# EasyEDA Pro project 4310_2025-11-30.epro

# Schematic Schematic1
Board Name: Board1; Create Date: 2025-10-22; Page Name: P1; Project Name: 4310_ms_new; Schematic Name: Schematic1; Update Date: 2025-10-28; Company: 嘉立创EDA; Page Size: A4; Version: V1.0
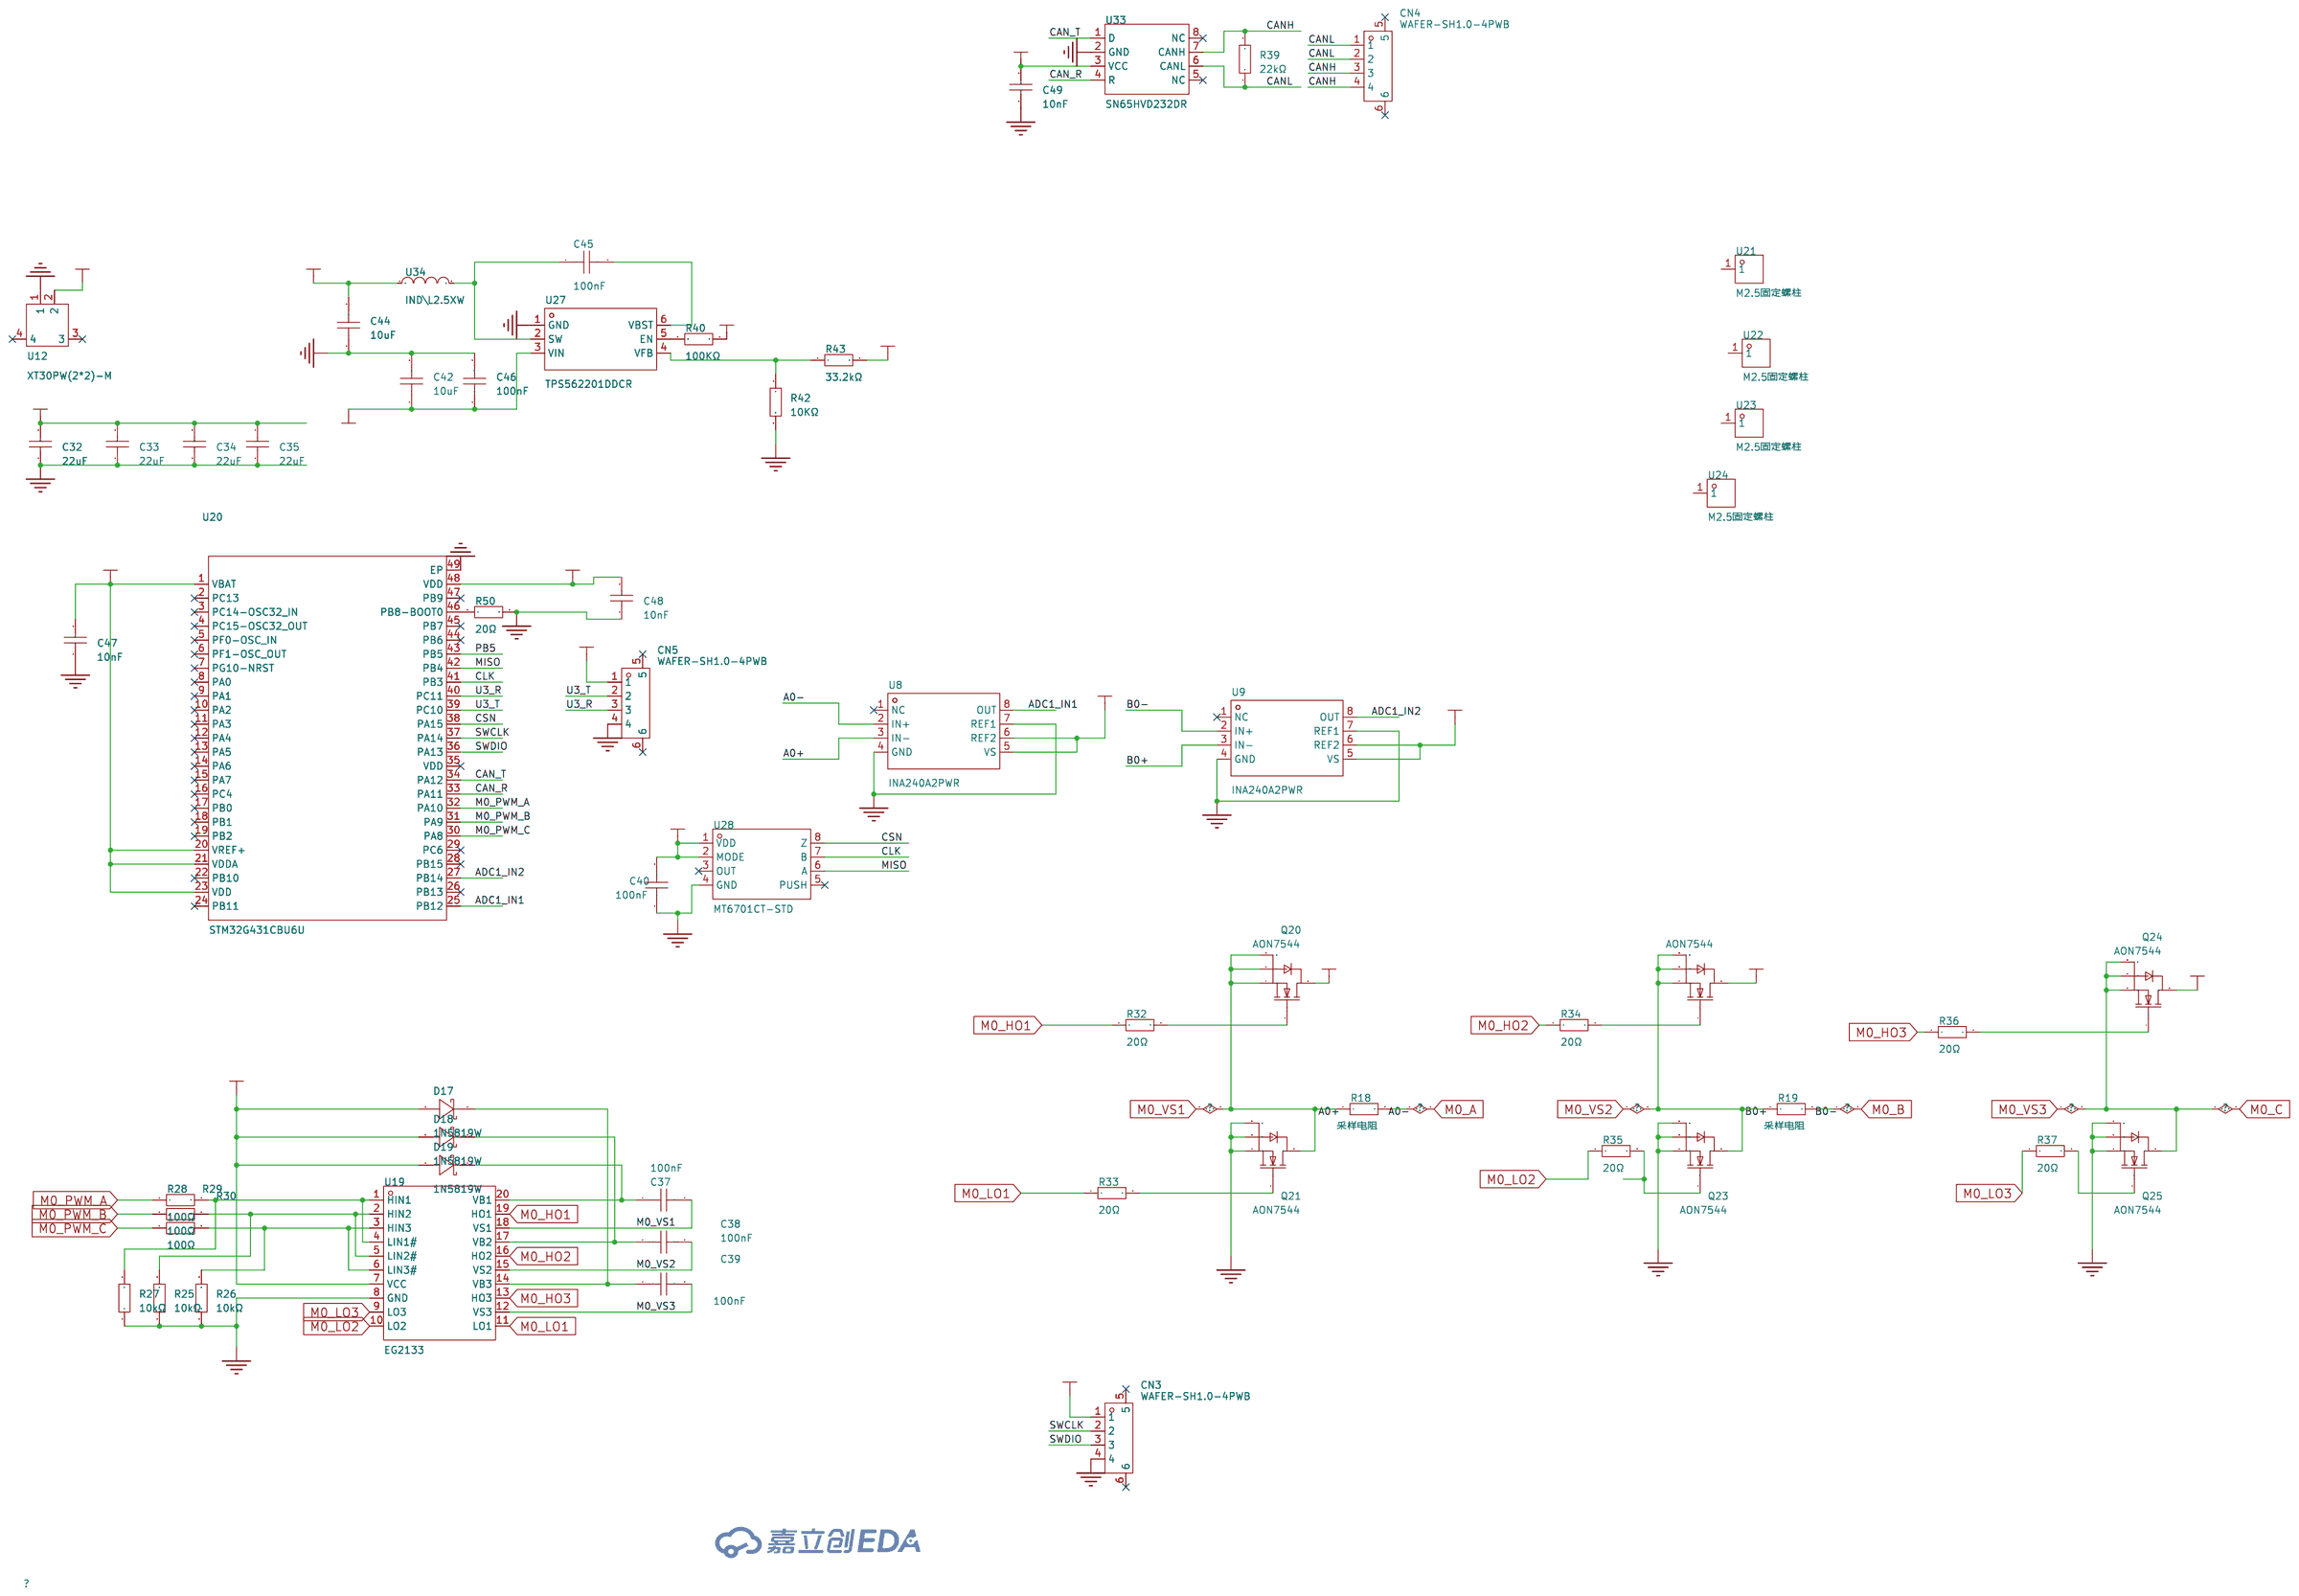
[diagram p0: schematic sheet]

## Parts
C32  22uF  [C1206]
C33  22uF  [C1206]
C34  22uF  [C1206]
C35  22uF  [C1206]
C37  100nF  [C0402]
C38  100nF  [C0402]
C39  100nF  [C0402]
C40  100nF  [C0603]
C42  10uF  [C0805]
C44  10uF  [C0805]
C45  100nF  [C0805]
C46  100nF  [C0805]
C47  10nF  [C0603]
C48  10nF  [C0603]
C49  10nF  [C0603]
CN3  WAFER-SH1.0-4PWB  [CONN-SMD_4P-P1.00_WAFER-SH1.0-4PWB]
CN4  WAFER-SH1.0-4PWB  [CONN-SMD_4P-P1.00_WAFER-SH1.0-4PWB]
CN5  WAFER-SH1.0-4PWB  [CONN-SMD_4P-P1.00_WAFER-SH1.0-4PWB]
D17  1N5819W  [SOD-123_L2.7-W1.6-LS3.7-RD-1]
D18  1N5819W  [SOD-123_L2.7-W1.6-LS3.7-RD-1]
D19  1N5819W  [SOD-123_L2.7-W1.6-LS3.7-RD-1]
Q20  AON7544  [DFN-8_L3.3-W3.3-P0.65-BL-2]
Q21  AON7544  [DFN-8_L3.3-W3.3-P0.65-BL-2]
Q22  AON7544  [DFN-8_L3.3-W3.3-P0.65-BL-2]
Q23  AON7544  [DFN-8_L3.3-W3.3-P0.65-BL-2]
Q24  AON7544  [DFN-8_L3.3-W3.3-P0.65-BL-2]
Q25  AON7544  [DFN-8_L3.3-W3.3-P0.65-BL-2]
R18  采样电阻  [R1206]
R19  采样电阻  [R1206]
R25  10kΩ  [R0402]
R26  10kΩ  [R0402]
R27  10kΩ  [R0402]
R28  100Ω  [R0402]
R29  100Ω  [R0402]
R30  100Ω  [R0402]
R32  20Ω  [R0402]
R33  20Ω  [R0402]
R34  20Ω  [R0402]
R35  20Ω  [R0402]
R36  20Ω  [R0402]
R37  20Ω  [R0402]
R39  22kΩ  [R0603]
R40  100KΩ  [R0603]
R42  10KΩ  [R0603]
R43  33.2kΩ  [R0603]
R50  20Ω  [R0603]
U8  INA240A2PWR  [TSSOP-8_L4.4-W3.0-P0.65-LS6.4-BL]
U9  INA240A2PWR  [TSSOP-8_L4.4-W3.0-P0.65-LS6.4-BL]
U12  XT30PW(2*2)-M  [CONN-TH_XT30PW-M]
U19  EG2133  [TSSOP-20_L6.5-W4.4-P0.65-LS6.4-BL]
U20  STM32G431CBU6U  [UFQFPN-48_L7.0-W7.0-P0.50-BL-EP5.6]
U21  M2.5固定螺柱  [SMD_BD5.0-L5.0-D2.6]
U22  M2.5固定螺柱  [SMD_BD5.0-L5.0-D2.6]
U23  M2.5固定螺柱  [SMD_BD5.0-L5.0-D2.6]
U24  M2.5固定螺柱  [SMD_BD5.0-L5.0-D2.6]
U27  TPS562201DDCR  [SOT-23-6_L2.9-W1.6-P0.95-LS2.8-BR]
U28  MT6701CT-STD  [SOP-8_L4.9-W3.9-P1.27-LS6.0-BL]
U33  SN65HVD232DR  [SOIC-8_L5.0-W4.0-P1.27-LS6.0-BL]
U34  IND\L2.5XW  [IND-SMD_L2.5-W2.0_YXNAQ252010-3R3M]

## Library data of the parts
C32-C35 = CL31A226KAHNNNE: 容值:22uF;精度:±10%;额定电压:25V;温度系数:X5R;; LCSC Part Name: 22uF ±10% 25V; Supplier Part: C12891; Manufacturer: SAMSUNG(三星); Supplier Footprint: 1206; JLCPCB Part Class: 基础库; Datasheet: https://item.szlcsc.com/datasheet/CL31A226KAHNNNE/13537.html; Supplier: LCSC; Tolerance: ±10%; Voltage Rating: 25V; Temperature Coefficient: X5R
C37-C39 = CL05B104KB54PNC: 容值:100nF;精度:±10%;额定电压:50V;温度系数:X7R;; LCSC Part Name: 100nF ±10% 50V; Supplier Part: C307331; Manufacturer: SAMSUNG(三星); Supplier Footprint: 0402; JLCPCB Part Class: 基础库; Datasheet: https://item.szlcsc.com/datasheet/CL05B104KB54PNC/291005.html; Supplier: LCSC; Tolerance: ±10%; Voltage Rating: 50V; Temperature Coefficient: X7R
C40 = TCC0603X7R104K500CTS: 容值:100nF;精度:±10%;额定电压:50V;温度系数:X7R;; LCSC Part Name: 100nF ±10% 50V; Supplier Part: C282520; Manufacturer: CCTC(三环); Supplier Footprint: 0603; JLCPCB Part Class: 扩展库; Datasheet: https://atta.szlcsc.com/upload/public/pdf/source/20190418/C282727_578BF1B2FA7A061368DB08C32C351B39.pdf; Supplier: LCSC; Tolerance: ±10%; Voltage Rating: 50V; Temperature Coefficient: X7R
C42 C44 = CL21A106KAYNNNE_C15850: 容值:10uF;精度:±10%;额定电压:25V;温度系数:X5R;; LCSC Part Name: 10uF ±10% 25V; Supplier Part: C15850; Manufacturer: SAMSUNG(三星); Manufacturer Part: CL21A106KAYNNNE; Supplier Footprint: 0805; JLCPCB Part Class: 基础库; Datasheet: https://item.szlcsc.com/datasheet/CL21A106KAYNNNE/16532.html; Supplier: LCSC; Tolerance: ±10%; Voltage Rating: 25V; Temperature Coefficient: X5R
C45 C46 = CC0805KRX7R9BB104: 容值:100nF;精度:±10%;额定电压:50V;温度系数:X7R;; LCSC Part Name: 100nF ±10% 50V; Supplier Part: C49678; Manufacturer: YAGEO(国巨); Supplier Footprint: 0805; JLCPCB Part Class: 基础库; Datasheet: https://item.szlcsc.com/datasheet/CC0805KRX7R9BB104/50686.html; Supplier: LCSC; Tolerance: ±10%; Voltage Rating: 50V; Temperature Coefficient: X7R
C47-C49 = 0603B103K500NT: 容值:10nF;精度:±10%;额定电压:50V;温度系数:X7R;; LCSC Part Name: 10nF ±10% 50V; Supplier Part: C57112; Manufacturer: FH(风华); Supplier Footprint: 0603; JLCPCB Part Class: 基础库; Datasheet: https://item.szlcsc.com/datasheet/0603B103K500NT/58143.html; Supplier: LCSC; Tolerance: ±10%; Voltage Rating: 50V; Temperature Coefficient: X7R
CN3-CN5 = WAFER-SH1.0-4PWB: 插针结构:1x4P;间距:1mm;安装方式:卧贴;总PIN数:4P;排数:1;每排PIN数:4;额定电流:1A;工作温度范围:-25℃~+85℃;; LCSC Part Name: 1x4P 间距:1mm 卧贴; Supplier Part: C3029343; Manufacturer: XUNPU(讯普); Supplier Footprint: SMD,P=1mm,卧贴; JLCPCB Part Class: 扩展库; Datasheet: https://atta.szlcsc.com/upload/public/pdf/source/20220527/1879B8210BD3B2006BCEAC1A40D397B6.pdf; Supplier: LCSC; Pins Structure: 1x4P; Pitch: 1mm; Mounting Style: 卧贴; Number of Pins: 4P; Number of Rows: 1; Number of PINs Per Row: 4; Current Rating (Max): 1A; Operating Temperature Range: -25℃~+85℃
D17-D19 = 1N5819W: 二极管配置:-;正向压降(Vf):900mV@3A;直流反向耐压(Vr):40V;平均整流电流(Io):1A;; LCSC Part Name: 电压:40V 电流:1A; Supplier Part: C2905650; Manufacturer: TECH PUBLIC(台舟); Supplier Footprint: SOD-123; JLCPCB Part Class: 扩展库; Datasheet: https://atta.szlcsc.com/upload/public/pdf/source/20211020/7FEA34DA99E5285CBA3CC87767B82BE7.pdf; Supplier: LCSC; Forward Voltage (Vf@If): 900mV@3A; Reverse Voltage (Vr): 40V; Average Rectified Current (Io): 1A; Reverse Leakage Current (Ir): 1mA@40V
Q20-Q25 = AON7544: 类型:1个N沟道;漏源电压(Vdss):30V;连续漏极电流(Id):30A;导通电阻(RDS(on)@Vgs,Id):8.5mΩ@4.5V,20A;功率(Pd):3W;阈值电压(Vgs(th)@Id):1.2V@250uA;; LCSC Part Name: 1个N沟道 耐压:30V 电流:30A; Supplier Part: C315567; Manufacturer: AOS; Supplier Footprint: DFN-8(3x3); JLCPCB Part Class: 扩展库; Datasheet: https://atta.szlcsc.com/upload/public/pdf/source/20190614/C315567_E434D67BCCEB23ABC813CC1BF26EA614.pdf; Supplier: LCSC; Type: 1个N沟道; Drain Source Voltage (Vdss): 30V; Continuous Drain Current (Id): 30A; Drain Source On Resistance (RDS(on)@Vgs,Id): 8.5mΩ@4.5V,20A; Power Dissipation (Pd): 3W; Gate Threshold Voltage (Vgs(th)@Id): 1.2V@250uA; Total Gate Charge (Qg@Vgs): 22.5nC@10V; Input Capacitance (Ciss@Vds): 951pF; Reverse Transfer Capacitance (Crss@Vds): 157pF; Operating Temperature: -55℃~+150℃
R18 R19 = Res_1206: Supplier Footprint: 1206
R25-R27 = 0402WGF1202TCE: 电阻类型:厚膜电阻;阻值:12kΩ;精度:±1%;功率:62.5mW;工作电压:50V;温度系数:±100ppm/℃;; LCSC Part Name: 12kΩ ±1% 62.5mW 厚膜电阻; Supplier Part: C25752; Manufacturer: UNI-ROYAL(厚声); Supplier Footprint: 0402; JLCPCB Part Class: 基础库; Datasheet: https://item.szlcsc.com/datasheet/0402WGF1202TCE/26495.html; Supplier: LCSC; Type: 厚膜电阻; Tolerance: ±1%; Power(Watts): 62.5mW; Voltage-Supply(Max): 50V; Temperature Coefficient: ±100ppm/℃; Operating Temperature: -55℃~+155℃
R28-R30 R32-R37 = 0402WGF1200TCE: 电阻类型:厚膜电阻;阻值:120Ω;精度:±1%;功率:62.5mW;工作电压:50V;温度系数:±100ppm/℃;; LCSC Part Name: 120Ω ±1% 62.5mW 厚膜电阻; Supplier Part: C25079; Manufacturer: UNI-ROYAL(厚声); Supplier Footprint: 0402; JLCPCB Part Class: 基础库; Datasheet: https://item.szlcsc.com/datasheet/0402WGF1200TCE/25822.html; Supplier: LCSC; Type: 厚膜电阻; Tolerance: ±1%; Power(Watts): 62.5mW; Voltage-Supply(Max): 50V; Temperature Coefficient: ±100ppm/℃; Operating Temperature: -55℃~+155℃
R39 = 0603WAF2202T5E: 电阻类型:厚膜电阻;阻值:22kΩ;精度:±1%;功率:100mW;最大工作电压:75V;温度系数:±100ppm/℃;; LCSC Part Name: 22kΩ ±1% 100mW 厚膜电阻; Supplier Part: C31850; Manufacturer: UNI-ROYAL(厚声); Supplier Footprint: 0603; JLCPCB Part Class: 基础库; Datasheet: https://atta.szlcsc.com/upload/public/pdf/source/20200306/C422600_1E6D84923E4A46A82E41ADD87F860B5C.pdf; Supplier: LCSC; Type: 厚膜电阻; Tolerance: ±1%; Power(Watts): 100mW; Overload Voltage (Max): 75V; Temperature Coefficient: ±100ppm/℃; Operating Temperature Range: -55℃~+155℃
R40 R42 = 0603WAF1004T5E: 电阻类型:厚膜电阻;阻值:1MΩ;精度:±1%;功率:100mW;; LCSC Part Name: 1MΩ ±1% 100mW; Supplier Part: C22935; Manufacturer: UNI-ROYAL(厚声); Supplier Footprint: 0603; JLCPCB Part Class: 基础库; Datasheet: https://atta.szlcsc.com/upload/public/pdf/source/20200306/C422600_1E6D84923E4A46A82E41ADD87F860B5C.pdf; Supplier: LCSC; Type: 厚膜电阻; Tolerance: ±1%; Power(Watts): 100mW; Temperature Coefficient: ±100ppm/℃; Overload Voltage (Max): 75V; Operating Temperature Range: -55℃~+155℃
R43 = 0603WAF750JT5E: 电阻类型:厚膜电阻;阻值:75Ω;精度:±1%;功率:100mW;工作电压:75V;温度系数:±100ppm/℃;; LCSC Part Name: 75Ω ±1% 100mW 厚膜电阻; Supplier Part: C4275; Manufacturer: UNI-ROYAL(厚声); Supplier Footprint: 0603; Datasheet: https://item.szlcsc.com/datasheet/0603WAF750JT5E/4682.html; Supplier: LCSC; Type: 厚膜电阻; Tolerance: ±1%; Power(Watts): 100mW; Voltage-Supply(Max): 75V; Temperature Coefficient: ±100ppm/℃; Operating Temperature: -55℃~+155℃
R50 = 0603WAF200JT5E: 电阻类型:厚膜电阻;阻值:20Ω;精度:±1%;功率:100mW;最大工作电压:75V;温度系数:±100ppm/℃;; LCSC Part Name: 20Ω ±1% 100mW 厚膜电阻; Supplier Part: C22950; Manufacturer: UNI-ROYAL(厚声); Supplier Footprint: 0603; JLCPCB Part Class: 基础库; Datasheet: https://atta.szlcsc.com/upload/public/pdf/source/20200306/C422600_1E6D84923E4A46A82E41ADD87F860B5C.pdf; Supplier: LCSC; Type: 厚膜电阻; Tolerance: ±1%; Power(Watts): 100mW; Overload Voltage (Max): 75V; Temperature Coefficient: ±100ppm/℃; Operating Temperature Range: -55℃~+155℃
U8 U9 = INA240A2PWR: 放大器数:单路;; Supplier Part: C129949; Manufacturer: TI(德州仪器); Supplier Footprint: TSSOP-8; JLCPCB Part Class: 扩展库; Datasheet: https://www.ti.com/cn/lit/gpn/ina240; Supplier: LCSC; Number of Channels: 单路; Supply Current: 1.8mA; Operating Temperature: -40℃~+125℃
U12 = XT30PW(2*2)-M: Supplier Part: C9900097120; JLCPCB Part Class: 扩展库; Supplier: LCSC
U19 = EG2133_C190343: EG2133是一款高性价比的三相半桥驱动芯片，配合六颗Nmos可以组成三相直流无刷电机驱动器。; Supplier Part: C190343; Manufacturer: EG(屹晶微); Supplier Footprint: TSSOP-20; JLCPCB Part Class: Extended Part; Datasheet: https://atta.szlcsc.com/upload/public/pdf/source/20220627/F8A393EEBF3325F22DCB485BC683267F.pdf; Supplier: LCSC
U20 = STM32G431CBU6U: CPU内核:CM4;程序存储容量:128KB;RAM总容量:32KB;GPIO端口数量:42;工作电压范围:1.71V~3.6V;CPU最大主频:170MHz;程序存储器类型:FLASH;; Supplier Part: C1341712; Manufacturer: ST(意法半导体); Supplier Footprint: UFQFPN-48(7x7); JLCPCB Part Class: 扩展库; Datasheet: https://atta.szlcsc.com/upload/public/pdf/source/20210607/F3CD0646E5D00AAFDE875C196C2D7333.pdf; Supplier: LCSC; CPU Core: CM4; Program Storage Size: 128KB; RAM Size: 32KB; GPIO Ports Number: 42; Operating Voltage Range: 1.71V~3.6V; CPU Maximum Speed: 170MHz; Program Memory Type: FLASH; Operating Temperature Range: -40℃~+85℃; ADC (Bit): 12bit; DAC (Bit): 12bit; Peripheral/Function: PWM；PWM; Internal Oscillator: 有
U21-U24 = M2.5固定螺柱: Supplier Part: C9900023457; Supplier Footprint: M2.5; JLCPCB Part Class: 扩展库; Supplier: LCSC
U27 = TPS562201DDCR: 功能类型:降压型;工作电压:4.5V~17V;输出电压:768mV~7V;输出电流:2A;输出类型:可调;; LCSC Part Name: 4.5V至17V输入、2A同步降压稳压器; Supplier Part: C90061; Manufacturer: TI(德州仪器); Supplier Footprint: SOT-6; JLCPCB Part Class: 扩展库; Datasheet: https://www.ti.com/cn/lit/gpn/tps562201; Supplier: LCSC; Function: 降压型; Voltage - Supply: 4.5V~17V; Output Voltage: 768mV~7V; Output Current: 2A; Frequency - Switching: 580kHz; Operating Temperature: -40℃~+125℃@(TJ); Synchronous Rectifier: 是; Number of Outputs: 1; Topology: 降压式; Switch tube (built-in/external): 内置; Output Type: 可调
U28 = MT6701CT-STD: 磁性编码器 磁性编码开关 磁性角度检测IC 可编程磁性角度位置芯片; LCSC Part Name: 霍尔在线编程角度位置传感器; Supplier Part: C2856764; Manufacturer: MagnTek(麦歌恩); Supplier Footprint: SOP-8; JLCPCB Part Class: 扩展库; Datasheet: https://atta.szlcsc.com/upload/public/pdf/source/20210901/89396AA55DF26524CEF7734A3D9C2FB3.pdf; Supplier: LCSC
U33 = SN65HVD232DR: 类型:CAN收发器;数据速率:1Mbps;; LCSC Part Name: 3.3-V CAN 收发器; Supplier Part: C30530; Manufacturer: TI(德州仪器); Supplier Footprint: SOIC-8; JLCPCB Part Class: 扩展库; Datasheet: https://www.ti.com/cn/lit/gpn/sn65hvd230; Supplier: LCSC; Type: CAN收发器; Data Rate: 1Mbps; Operating Temperature: -40℃~+85℃
U34 = IND\L2.5XW: Supplier Part: C9900016568; Supplier Footprint: 2.2uH/60; JLCPCB Part Class: 扩展库; Supplier: LCSC

## Nets
GND: C32.1 C33.1 C34.1 C35.1 C40.1 C42.2 C44.1 C46.2 C47.1 C48.1 C49.1 CN3.4 CN5.4 Q21.1(S) Q21.2(S) Q21.3(S) Q23.1(S) Q23.2(S) Q23.3(S) Q25.1(S) Q25.2(S) Q25.3(S) R25.1 R26.1 R27.1 R42.2 R50.2 U8.4(GND) U8.7(REF1) U9.4(GND) U9.7(REF1) U12.1 U19.8(GND) U20.49(EP) U27.1(GND) U28.4(GND) U33.2(GND)
VCC_3.3V: C40.2 C44.2 C47.2 C48.2 C49.2 CN3.1 CN5.1 R43.2 U8.5(VS) U8.6(REF2) U9.5(VS) U9.6(REF2) U20.1(VBAT) U20.20(VREF+) U20.21(VDDA) U20.23(VDD) U20.48(VDD) U28.1(VDD) U28.2(MODE) U33.3(VCC) U34.1
A0+: C37.2 Q20.1(S) Q20.2(S) Q20.3(S) Q21.5(D) R18.1 U8.3(IN-) U19.18(VS1)
A0-: R18.2 U8.2(IN+)
ADC1_IN1: U8.8(OUT) U20.25(PB12)
ADC1_IN2: U9.8(OUT) U20.27(PB14)
B0+: C38.2 Q22.1(S) Q22.2(S) Q22.3(S) Q23.5(D) R19.1 U9.3(IN-) U19.15(VS2)
B0-: R19.2 U9.2(IN+)
CAN_R: U20.33(PA11) U33.4(R)
CAN_T: U20.34(PA12) U33.1(D)
CANH: CN4.3 CN4.4 R39.2 U33.7(CANH)
CANL: CN4.1 CN4.2 R39.1 U33.6(CANL)
CLK: U20.41(PB3) U28.7(B)
CSN: U20.38(PA15) U28.8(Z)
M0_C: C39.2 Q24.1(S) Q24.2(S) Q24.3(S) Q25.5(D) U19.12(VS3)
M0_HO1: R32.1 U19.19(HO1)
M0_HO2: R34.1 U19.16(HO2)
M0_HO3: R36.1 U19.13(HO3)
M0_LO1: R33.1 U19.11(LO1)
M0_LO2: R35.1 U19.10(LO2)
M0_LO3: R37.1 U19.9(LO3)
M0_PWM_A: R28.1 U20.32(PA10)
M0_PWM_B: R29.1 U20.31(PA9)
M0_PWM_C: R30.1 U20.30(PA8)
MISO: U20.42(PB4) U28.6(A)
PB5: U20.43(PB5)
SWCLK: CN3.2 U20.37(PA14)
SWDIO: CN3.3 U20.36(PA13)
U3_R: CN5.3 U20.40(PC11)
U3_T: CN5.2 U20.39(PC10)
VM: C32.2 C33.2 C34.2 C35.2 C42.1 C46.1 D17.2(A) D18.2(A) D19.2(A) Q20.5(D) Q22.5(D) Q24.5(D) R40.1 U12.2 U19.7(VCC) U27.3(VIN)
$1N3270: Q20.4(G) R32.2
$1N3271: Q21.4(G) R33.2
$1N3277: Q22.4(G) R34.2
$1N3278: Q23.4(G) R35.2
$1N3284: Q24.4(G) R36.2
$1N3285: Q25.4(G) R37.2
$1N3290: R25.2 R29.2 U19.2(HIN2) U19.5(LIN2#)
$1N3300: C37.1 D19.1(K) U19.20(VB1)
$1N3301: C38.1 D18.1(K) U19.17(VB2)
$1N3302: C39.1 D17.1(K) U19.14(VB3)
$1N3388: R27.2 R28.2 U19.1(HIN1) U19.4(LIN1#)
$1N3389: R26.2 R30.2 U19.3(HIN3) U19.6(LIN3#)
$1N3414: C45.1 U27.2(SW) U34.2
$1N3417: C45.2 U27.6(VBST)
$1N3418: R40.2 U27.5(EN)
$1N3419: R42.1 R43.1 U27.4(VFB)
$1N10197: R50.1 U20.46(PB8-BOOT0)

Not connected (* = marked no-connect by the designer): CN3 5* 6*; CN4 5* 6*; CN5 5* 6*; U8 1(NC)*; U9 1(NC)*; U12 3* 4*; U20 2(PC13)* 3(PC14-OSC32_IN)* 4(PC15-OSC32_OUT)* 5(PF0-OSC_IN)* 6(PF1-OSC_OUT)* 7(PG10-NRST)* 8(PA0)* 9(PA1)* 10(PA2)* 11(PA3)* 12(PA4)* 13(PA5)* 14(PA6)* 15(PA7)* 16(PC4)* 17(PB0)* 18(PB1)* 19(PB2)* 22(PB10)* 24(PB11)* 26(PB13)* 28(PB15)* 29(PC6)* 35(VDD)* 44(PB6)* 45(PB7)* 47(PB9)*; U21 1; U22 1; U23 1; U24 1; U28 3(OUT)* 5(PUSH)*; U33 5(NC)* 8(NC)*

# Board PCB1
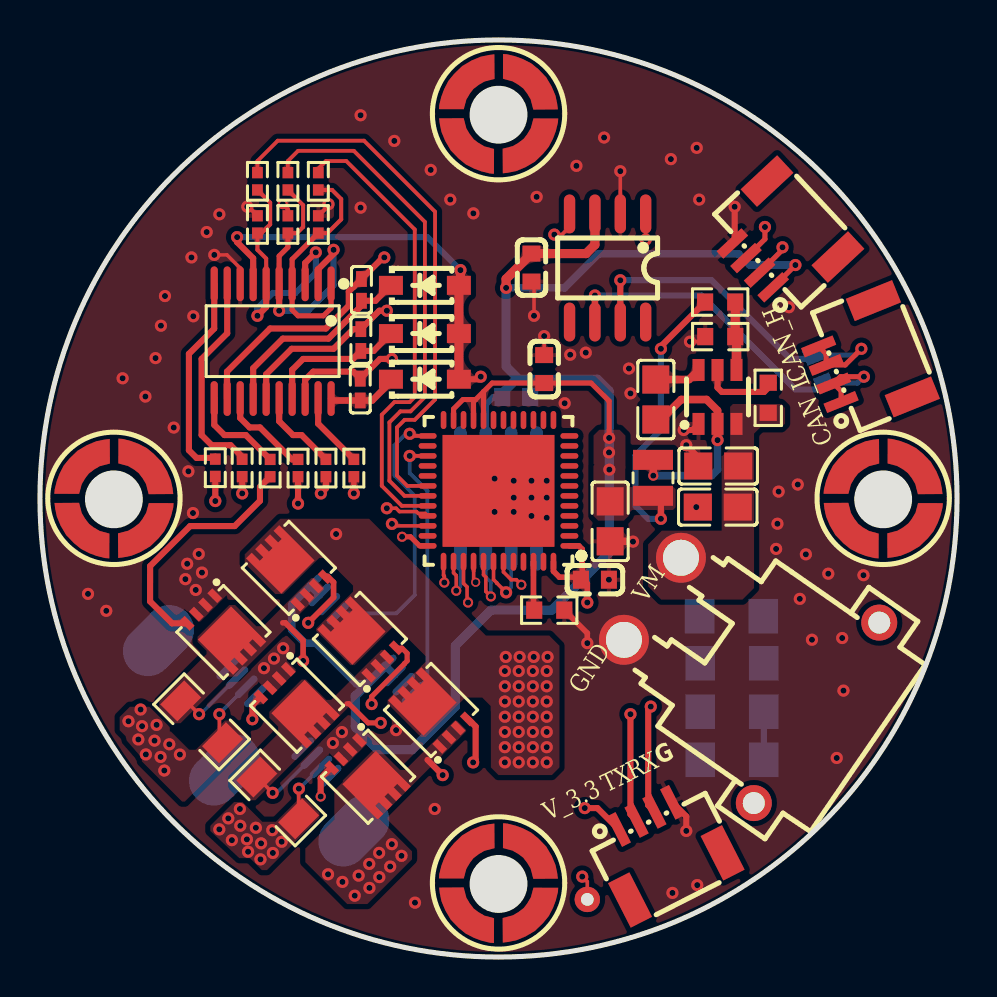
[diagram p1: board, top side]
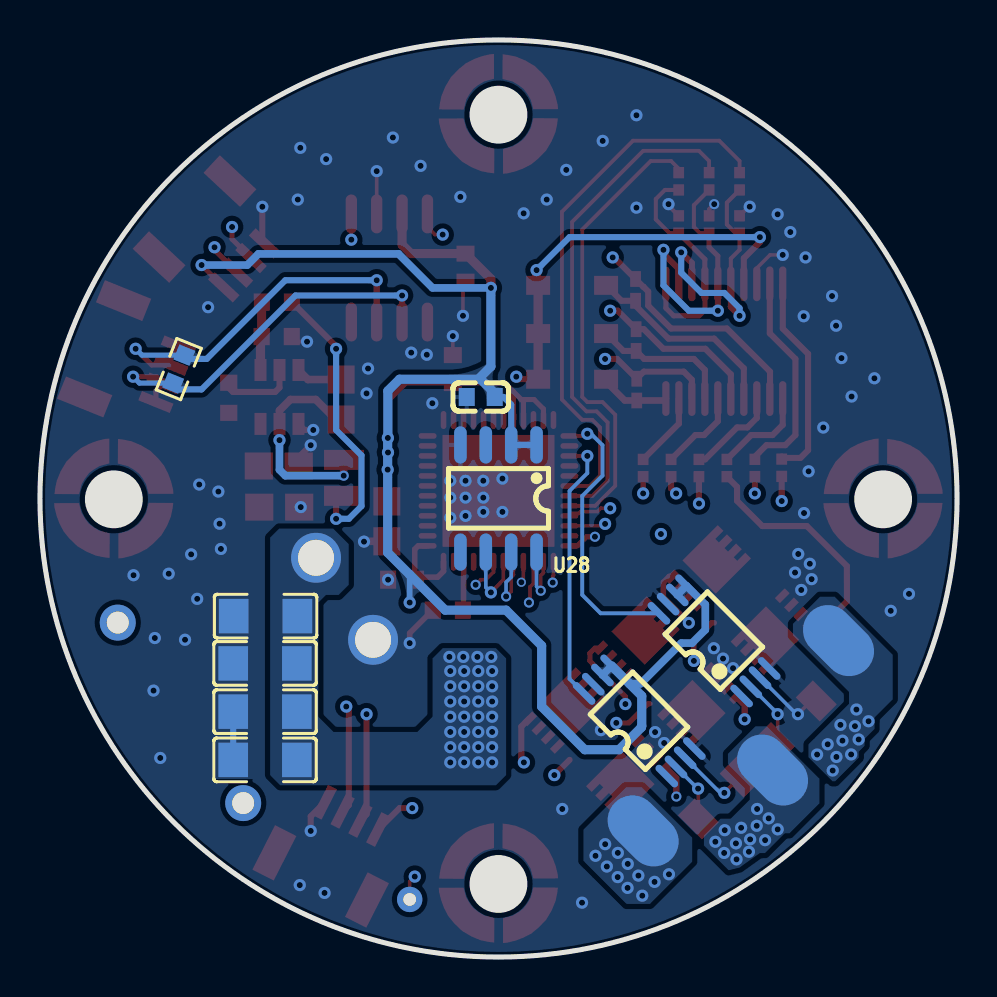
[diagram p2: board, bottom side, seen from below]

Outline 45.9 x 45.9 mm; copper layers: Top Layer, Inner1, Inner2, Bottom Layer. Coordinates in mm from the lower left corner of the outline.
Outline path: circle c22.95,22.95 r22.95
Stack: Top Layer 0.035mm 外层铜厚1oz / Dielectric1 0.2104mm 7628 RC49% 8.6mil / Inner1 0.0152mm 内层铜厚 / Dielectric2 1.065mm 1.1mm H/HOZ Copper / Inner2 0.0152mm 内层铜厚 / Dielectric3 0.2104mm 7628 RC49% 8.6mil / Bottom Layer 0.035mm 外层铜厚1oz

## Design rules (mm)
template: 自定义配置
spacing copperThickness1oz (default): track to track 0.102, other pairs 0.152 to 0.3
spacing copperThickness2oz: track to track 0.203, other pairs 0.152 to 0.3
track width copperThickness1oz (default): min 0.127, default 0.254, max 2.54
track width copperThickness2oz: min 0.203, default 0.254, max 2.54
differential pair differentialPair (default): width min 0.127, default 0.254, max 2.54; gap min 0.152, default 0.152
via viaSize (default): diameter min 0.457, default 0.61, max 10; hole min 0.3, default 0.305, max 6.3

## Placement (name value [footprint] x y rotation side)
C32  22uF  [C1206]  34.61 17.06 180 bottom
C33  22uF  [C1206]  34.63 14.69 180 bottom
C34  22uF  [C1206]  34.63 12.28 180 bottom
C35  22uF  [C1206]  34.63 9.87 180 bottom
C37  100nF  [C0402]  16.03 28.4 90 top
C38  100nF  [C0402]  16.06 30.88 90 top
C39  100nF  [C0402]  16.09 33.39 90 top
C40  100nF  [C0603]  23.84 28.03 180 bottom
C42  10uF  [C0805]  33.92 22.52 180 top
C44  10uF  [C0805]  28.54 21.81 90 top
C45  100nF  [C0805]  30.82 27.9 90 top
C46  100nF  [C0805]  33.94 24.58 180 top
C47  10nF  [C0603]  25.24 29.43 270 top
C48  10nF  [C0603]  27.78 18.89 180 top
C49  10nF  [C0603]  24.6 34.51 90 top
CN3  WAFER-SH1.0-4PWB  [CONN-SMD_4P-P1.00_WAFER-SH1.0-4PWB]  36.92 35.78 133 top
CN4  WAFER-SH1.0-4PWB  [CONN-SMD_4P-P1.00_WAFER-SH1.0-4PWB]  41.11 29.81 112 top
CN5  WAFER-SH1.0-4PWB  [CONN-SMD_4P-P1.00_WAFER-SH1.0-4PWB]  31.08 5.55 27 top
D17  1N5819W  [SOD-123_L2.7-W1.6-LS3.7-RD-1]  19.27 33.62 0 top
D18  1N5819W  [SOD-123_L2.7-W1.6-LS3.7-RD-1]  19.27 31.2 0 top
D19  1N5819W  [SOD-123_L2.7-W1.6-LS3.7-RD-1]  19.27 28.92 0 top
NOREF  -  [Pad_e1705]  9.23 9.36 135 top
NOREF#2  -  [Pad_e1706]  15.71 6.31 135 top
NOREF#3  -  [Pad_e1704]  5.93 15.84 135 top
NOREF#4  -  [Pad_e1522]  27.39 2.88 0 top
Q20  AON7544  [DFN-8_L3.3-W3.3-P0.65-BL-2]  13.04 18.89 45 top
Q21  AON7544  [DFN-8_L3.3-W3.3-P0.65-BL-2]  8.6 16.85 225 top
Q22  AON7544  [DFN-8_L3.3-W3.3-P0.65-BL-2]  16.6 15.33 45 top
Q23  AON7544  [DFN-8_L3.3-W3.3-P0.65-BL-2]  12.28 13.17 225 top
Q24  AON7544  [DFN-8_L3.3-W3.3-P0.65-BL-2]  20.16 11.77 45 top
Q25  AON7544  [DFN-8_L3.3-W3.3-P0.65-BL-2]  15.84 9.61 225 top
R18  采样电阻  [R1206]  8.09 11.77 315 top
R19  采样电阻  [R1206]  11.9 7.96 315 top
R25  10kΩ  [R0402]  12.41 36.67 270 top
R26  10kΩ  [R0402]  10.88 36.67 270 top
R27  10kΩ  [R0402]  13.93 36.67 270 top
R28  100Ω  [R0402]  13.93 38.82 270 top
R29  100Ω  [R0402]  12.41 38.82 270 top
R30  100Ω  [R0402]  10.88 38.82 270 top
R32  20Ω  [R0402]  15.71 24.47 270 top
R33  20Ω  [R0402]  11.52 24.47 270 top
R34  20Ω  [R0402]  14.31 24.47 270 top
R35  20Ω  [R0402]  8.78 24.49 270 top
R36  20Ω  [R0402]  12.92 24.47 270 top
R37  20Ω  [R0402]  10.12 24.48 270 top
R39  22kΩ  [R0603]  38.95 29.43 112 bottom
R40  100KΩ  [R0603]  36.45 27.99 90 top
R42  10KΩ  [R0603]  34.05 31.05 180 top
R43  33.2kΩ  [R0603]  34.04 32.78 180 top
R50  20Ω  [R0603]  25.49 17.36 0 top
U8  INA240A2PWR  [TSSOP-8_L4.4-W3.0-P0.65-LS6.4-BL]  12.16 15.82 135 bottom
U9  INA240A2PWR  [TSSOP-8_L4.4-W3.0-P0.65-LS6.4-BL]  15.91 11.82 135 bottom
U12  XT30PW(2*2)-M  [CONN-TH_XT30PW-M]  34.76 15.08 55.2 top
U19  EG2133  [TSSOP-20_L6.5-W4.4-P0.65-LS6.4-BL]  11.65 30.82 180 top
U20  STM32G431CBU6U  [UFQFPN-48_L7.0-W7.0-P0.50-BL-EP5.6]  22.95 23.33 90 top
U21  M2.5固定螺柱  [SMD_BD5.0-L5.0-D2.6]  22.95 3.7 0 top
U22  M2.5固定螺柱  [SMD_BD5.0-L5.0-D2.6]  3.7 22.95 0 top
U23  M2.5固定螺柱  [SMD_BD5.0-L5.0-D2.6]  22.95 42.2 0 top
U24  M2.5固定螺柱  [SMD_BD5.0-L5.0-D2.6]  42.2 22.95 0 top
U27  TPS562201DDCR  [SOT-23-6_L2.9-W1.6-P0.95-LS2.8-BR]  33.91 28.03 270 top
U28  MT6701CT-STD  [SOP-8_L4.9-W3.9-P1.27-LS6.0-BL]  22.95 22.95 0 bottom
U33  SN65HVD232DR  [SOIC-8_L5.0-W4.0-P1.27-LS6.0-BL]  28.41 34.49 180 top
U34  IND\L2.5XW  [IND-SMD_L2.5-W2.0_YXNAQ252010-3R3M]  30.68 23.98 270 top

## Footprints (pads in the part's own frame, mm; a bottom-side part is the same pattern mirrored in y, then rotated)
C0402
  rect 0.79x0.54 smd: 1(-0.545,0) 2(0.545,0)
C0603
  rect 0.8x0.9 smd: 1(-0.7,0) 2(0.7,0)
C0805
  rect 1.41x1.35 smd: 1(-1,0) 2(1,0)
C1206
  rect 1.485x1.728 smd: 1(-1.593,0) 2(1.593,0)
CONN-SMD_4P-P1.00_WAFER-SH1.0-4PWB
  rect 0.5x1.7 smd: 1(-1.5,1.7) 2(-0.5,1.7) 3(0.5,1.7) 4(1.5,1.7)
  rect 1.2x2.5 smd: 5(-2.6,-1.7) 6(2.6,-1.7)
CONN-TH_XT30PW-M
  round 2.5 hole 1.8: 1(-2.5,5) 2(2.5,5)
  round 1.8 hole 1.1: 3(5.5,-5) 4(-5.5,-5)
DFN-8_L3.3-W3.3-P0.65-BL-2
  rect 0.35x0.7 smd: 1(-0.975,-0.765) 2(-0.325,-0.765) 3(0.325,-0.765) 4(0.975,-0.765)
  custom 2.352x2.498 smd: 5(0,0.765)
IND-SMD_L2.5-W2.0_YXNAQ252010-3R3M
  rect 1x2 smd: 1(0.9,0) 2(-0.9,0)
Pad_e1522
  round 1.27 hole 0.635: 1(0,0)
Pad_e1704
  rrect 2.5x4 smd far side: 1(0,0)
Pad_e1705
  rrect 2.5x4 smd far side: 1(0,0)
Pad_e1706
  rrect 2.5x4 smd far side: 1(0,0)
R0402
  rect 0.566x0.54 smd: 1(-0.433,0) 2(0.433,0)
R0603
  rect 0.806x0.864 smd: 1(-0.753,0) 2(0.753,0)
R1206
  rect 1.208x1.701 smd: 1(-1.479,0) 2(1.479,0)
SMD_BD5.0-L5.0-D2.6
  custom 2.75x2.784 smd: 1(-1.599,-1.645) 1(1.598,1.645)
  custom 2.784x2.749 smd: 1(-1.589,1.638) 1(1.599,-1.633)
SOD-123_L2.7-W1.6-LS3.7-RD-1
  rect 1.2x0.95 smd: 1(-1.7,0) 2(1.7,0)
SOIC-8_L5.0-W4.0-P1.27-LS6.0-BL
  oval 0.569x1.95 smd: 1(-1.905,-2.705) 2(-0.635,-2.705) 3(0.635,-2.705) 4(1.905,-2.705) 5(1.905,2.705) 6(0.635,2.705) 7(-0.635,2.705) 8(-1.905,2.705)
SOP-8_L4.9-W3.9-P1.27-LS6.0-BL
  oval 0.63x1.865 smd: 1(-1.905,-2.683) 2(-0.635,-2.683) 3(0.635,-2.683) 4(1.905,-2.683) 5(1.905,2.683) 6(0.635,2.683) 7(-0.635,2.683) 8(-1.905,2.683)
SOT-23-6_L2.9-W1.6-P0.95-LS2.8-BR
  rect 1.1x0.6 smd: 1(1.35,-0.95) 2(1.35,0) 3(1.35,0.95) 4(-1.35,0.95) 5(-1.35,0) 6(-1.35,-0.95)
TSSOP-8_L4.4-W3.0-P0.65-LS6.4-BL
  oval 0.353x1.454 smd: 1(-0.975,-2.927) 2(-0.325,-2.927) 3(0.325,-2.927) 4(0.975,-2.927) 5(0.975,2.927) 6(0.325,2.927) 7(-0.325,2.927) 8(-0.975,2.927)
TSSOP-20_L6.5-W4.4-P0.65-LS6.4-BL
  oval 0.364x1.742 smd: 1(-2.925,-2.871) 2(-2.275,-2.871) 3(-1.625,-2.871) 4(-0.975,-2.871) 5(-0.325,-2.871) 6(0.325,-2.871) 7(0.975,-2.871) 8(1.625,-2.871) 9(2.275,-2.871) 10(2.925,-2.871) 11(2.925,2.871) 12(2.275,2.871) 13(1.625,2.871) 14(0.975,2.871) 15(0.325,2.871) 16(-0.325,2.871) 17(-0.975,2.871) 18(-1.625,2.871) 19(-2.275,2.871) 20(-2.925,2.871)
UFQFPN-48_L7.0-W7.0-P0.50-BL-EP5.6
  oval 0.28x0.9 smd: 1(-2.751,-3.547) 2(-2.251,-3.547) 3(-1.75,-3.547) 4(-1.25,-3.547) 5(-0.75,-3.547) 6(-0.249,-3.547) 7(0.249,-3.547) 8(0.75,-3.547) 9(1.25,-3.547) 10(1.75,-3.547) 11(2.251,-3.547) 12(2.751,-3.547) 25(2.751,3.547) 26(2.251,3.547) 27(1.75,3.547) 28(1.25,3.547) 29(0.75,3.547) 30(0.249,3.547) 31(-0.249,3.547) 32(-0.75,3.547) 33(-1.25,3.547) 34(-1.75,3.547) 35(-2.251,3.547) 36(-2.751,3.547)
  oval 0.9x0.28 smd: 13(3.547,-2.75) 14(3.547,-2.25) 15(3.547,-1.75) 16(3.547,-1.25) 17(3.547,-0.75) 18(3.547,-0.25) 19(3.547,0.25) 20(3.547,0.75) 21(3.547,1.25) 22(3.547,1.75) 23(3.547,2.25) 24(3.547,2.75) 37(-3.547,2.751) 38(-3.547,2.251) 39(-3.547,1.75) 40(-3.547,1.25) 41(-3.547,0.75) 42(-3.547,0.249) 43(-3.547,-0.249) 44(-3.547,-0.75) 45(-3.547,-1.25) 46(-3.547,-1.75) 47(-3.547,-2.251) 48(-3.547,-2.751)
  rect 5.6x5.6 smd: 49(0,0)

## Nets
As in the schematic, except:
A0-: NOREF#3.1 R18.2 U8.2
B0-: NOREF.1 R19.2 U9.2
M0_C: C39.2 NOREF#2.1 Q24.1 Q24.2 Q24.3 Q25.5 U19.12
PB5: NOREF#4.1 U20.43

Pads without a net: CN3 5 6; CN4 5 6; CN5 5 6; U8 1; U9 1; U12 3 4; U20 2 3 4 5 6 7 8 9 10 11 12 13 14 15 16 17 18 19 22 24 26 28 29 35 44 45 47; U21 1; U22 1; U23 1; U24 1; U28 3 5; U33 5 8

## Via types
v1: diameter 0.61, hole 0.305, Top Layer to Bottom Layer, 205 vias
v2: diameter 0.508, hole 0.305, Top Layer to Bottom Layer, 9 vias
v3: diameter 0.457, hole 0.305, Top Layer to Bottom Layer, 1 via

## Routing (per net, layer and track width the routed paths; a pad name or vN(x,y) marks a point on that pad's centre or on a via; arc(x,y) is an arc through that point)
GND: length 21.7
  Top Layer w0.178: C47.1 v1(25.24,31.08) ; v1(24.73,32.09) 24.73,33.68 C49.1 ; v1(8.73,35.14) 9.36,35.14 10.02,34.48 U19.8 ; U33.2 v1(29.05,39.33)
  Top Layer w0.191: v1(32.53,30.8) 33.04,30.8 R42.2
  Top Layer w0.203: R25.1 12.41,37.43 v2(12.15,37.68) ; v1(10.38,37.55) 10.43,37.55 R26.1 ; v1(14.44,37.68) 14.44,37.61 R27.1
  Top Layer w0.28: v1(27.39,15.71) 27.39,16.21 R50.2
  Top Layer w0.305: CN5.4 32.35,7.04 v1(32.35,6.31) ; C46.2 32.94,25.02 v1(32.35,25.62) ; v1(34.77,37.55) 34.77,35.78 34.71,35.72 ; U27.1 32.66,26.38 v1(32.22,26.38)
  Top Layer w0.381: v1(29.68,20.79) 29.66,20.81 C44.1
  Bottom Layer w0.305: C35.1 C34.1
  vias: v1(2.41,18.18) v1(3.32,17.33) v1(4.14,28.97) v1(5.28,28.05) v1(5.78,29.98) v1(6.05,31.6) v1(6.26,33.08) v1(6.7,26.5) v1(7.28,18.91) v1(7.37,19.68) v1(7.43,24.31) v1(7.58,35.01) v1(7.67,32.07) v1(7.66,22.22) v1(7.8,18.37) v1(7.95,20.17) v1(8.11,19.24) v1(8.34,36.28) v1(8.98,37.17) v1(11.21,14.46) v1(11.71,14.94) v1(12.17,15.46) v1(14.66,10.71) v1(15.11,11.26) v1(16.05,42.13) v1(16.05,37.5) v1(17.73,40.85) v1(17.82,11.36) v1(18.77,2.72) v1(19.56,39.4) v1(19.76,7.41) v1(20.54,37.91) v1(21.69,37.22) v1(22.75,23.94) v1(22.75,22.28) v1(23.71,23.84) v1(23.71,22.99) v1(23.71,22.28) v1(24.6,23.84) v1(24.6,22.99) v1(24.6,22.08) v1(24.86,38.04) v1(25.36,23.84) v1(25.36,22.99) v1(25.36,21.99) v1(26.26,27.72) v1(26.54,30.14) v1(26.85,39.6) v1(27.32,30.25) v1(28.23,41.02) v1(28.48,18.89) v1(29.48,29.45) v1(29.55,28.21) v1(31.58,39.94) v1(31.66,3.21) v1(32.87,40.5) v1(32.85,22.52) v1(32.9,3.6) v1(32.99,37.91) v1(36.84,20.43) v1(36.97,23.3) v1(36.91,21.69) v1(37.48,32.52) v1(37.93,23.65) v1(38.03,17.93) v1(38.33,20.15) v1(38.64,15.88) v1(39.45,19.19) v1(39.88,9.96) v1(40.15,15.97) v1(40.21,13.33) v1(41.22,19.11)
VCC_3.3V: length 127.1
  Top Layer w0.254: 21.81,27.9 21.17,27.9 20.7,27.43 U20.23 ; 21.81,27.9 21.7,27.8 U20.21 ; 21.81,27.9 22.2,28.3 ; 22.2,28.3 22.63,28.73 C47.2 27.59,28.73 28.49,27.83 v1(28.49,25.98) ; 22.2,28.3 U20.20 ; v1(37.81,34.63) 37.81,34.63 CN3.1
  Top Layer w0.28: v1(27.39,17.74) 27.39,18.69 27.08,19.01 ; 27.08,19.01 27.14,19.08 27.14,20.41 26.97,20.58 U20.1 ; 27.08,19.01 26,19.01 25.7,19.31 U20.48
  Top Layer w0.305: v1(31.08,21.93) 31.08,22.69 U34.1 ; CN5.1 27.9,7.46 v1(27.27,7.46) ; R43.2 31.08,30.57 v1(31.08,30.44)
  Top Layer w0.457: v1(23.33,33.49) 23.33,33.94 C49.2 27.33,35.21 27.78,35.65 U33.3
  Inner2 w0.305: v1(27.39,17.74) 26.51,16.85 26.51,14.82 26.89,14.44 26.89,7.84 v1(27.27,7.46)
  Bottom Layer w0.28: 27.39,19.14 v1(27.39,17.74)
  Bottom Layer w0.305: v1(31.08,30.44) 31.08,26.38 29.81,25.11 29.81,22.57 30.44,21.93 v1(31.08,21.93) ; U28.1 U28.2 22.31,27.65 22.7,28.03 23.14,28.03
  Bottom Layer w0.381: U8.6 U8.5 12.6,17.64 12.6,16.38 13.27,15.71 13.81,15.71 15.84,13.68 16.39,13.68 ; v1(37.81,34.63) 35.52,34.63 34.96,35.19 27.95,35.19 26.25,33.49 v1(23.33,33.49) ; 17.75,14.11 17.29,14.57
  Bottom Layer w0.457: 23.14,28.03 23.14,28.22 23.84,28.92 23.97,28.92 ; v1(23.33,33.49) 23.33,29.55 23.97,28.92 ; 23.97,28.92 27.9,28.92 28.49,28.33 v1(28.49,25.98) 28.5,25.97 v1(28.5,24.39) 28.5,20.24 25.62,17.36 22.57,17.36 20.79,15.58 20.79,12.54 18.63,10.38 16.91,10.38 15.8,11.49 15.8,11.54 15.78,11.56 15.78,13.07 16.39,13.68 17.29,14.57
  vias: v1(28.48,25.25)
A0+: length 29.5
  Top Layer w0.178: v1(7.96,12.15) 7.3,12.82 R18.1
  Top Layer w0.28: v1(13.17,14.82) 13.17,15.84 12.28,16.73 12.15,16.73
  Top Layer w0.305: U19.18 13.27,28.89 13.68,29.3 15.68,29.3 C37.2 17.02,29.93 v1(17.62,29.93)
  Inner1 w0.305: v1(17.62,29.93) 16.73,29.05 16.73,17.87 13.68,14.82 v1(13.17,14.82)
  Bottom Layer w0.178: v1(7.96,12.15) 8.03,12.15 U8.3
A0-: length 3.4
  Top Layer w0.178: R18.2 8.98,10.88 v1(8.98,12.15)
  Bottom Layer w0.178: v1(8.98,12.15) 8.98,12.18 U8.2
  vias: v1(4.43,11.8) v1(4.92,10.89) v1(5.04,12.39) v1(5.11,11.55) v1(5.3,10.14) v1(5.73,10.83) v1(5.84,11.62) v1(6.04,10.01) v1(6.22,9.33) v1(6.47,10.65) v1(7,10.14)
ADC1_IN1: length 14.1
  Top Layer w0.191: v1(18.5,26.19) 18.61,26.08 U20.25
  Bottom Layer w0.191: v1(18.5,26.19) 18.31,26.19 17.74,25.62 17.74,24.09 18.76,23.08 18.76,18.12 17.84,17.2 U8.8
ADC1_IN2: length 13.5
  Top Layer w0.191: U20.27 v1(18.5,25.08)
  Bottom Layer w0.191: v1(18.5,25.08) 18.5,24.22 19.39,23.33 19.39,13.92 U9.8
B0+: length 37.5
  Top Layer w0.178: v1(11.65,8.22) R19.1
  Top Layer w0.254: 15.36,12.68 15.46,12.68 16.42,11.72 v1(17.05,11.72)
  Top Layer w0.305: U19.15 11.32,29.17 12.6,30.44 14.7,30.44 15.68,31.43 C38.2 16.98,32.35 v1(17.36,32.35)
  Inner1 w0.305: v1(17.05,11.72) 18.89,13.55 18.89,22.7 17.36,24.22 17.36,27.65 18.63,28.92 18.63,31.08 v1(17.36,32.35)
  Bottom Layer w0.178: v1(11.65,8.22) 11.85,8.22 U9.3
B0-: length 3.1
  Top Layer w0.178: v1(12.96,8.43) 12.95,8.42 R19.2
  Bottom Layer w0.178: 14.07,9.52 12.98,8.43 v1(12.96,8.43)
  vias: v1(8.98,6.39) v1(9.43,6.94) v1(9.61,5.85) v1(10.01,7.41) v1(10.03,6.57) v1(10.36,5.89) v1(10.42,5.27) v1(10.81,6.47) v1(11.07,5.69) v1(11.04,4.89) v1(11.63,6.35) v1(11.66,5.21) v1(12.1,5.77)
CAN_R: length 24.1
  Top Layer w0.178: v1(17.36,22.46) 17.83,22.46 17.99,22.29 18.84,22.29 18.93,22.2 19.28,22.2 U20.33 ; v1(25.74,36.16) 26.12,36.16 26.51,36.54 U33.4
  Inner2 w0.178: v1(25.74,36.16) 20.28,36.16 19.65,35.52 19.65,24.75 v1(17.36,22.46)
CAN_T: length 28
  Top Layer w0.178: U20.34 17.71,21.58 v1(17.62,21.68) ; v1(30.32,35.9) U33.1
  Inner2 w0.178: v1(30.32,35.9) 29.93,35.52 20.79,35.52 20.16,34.89 20.16,24.22 v1(17.62,21.68)
CANH: length 18.9
  Top Layer w0.254: 38.97,30.56 39.35,30.19 CN4.3 40.3,29.63 v1(41.11,30.44)
  Top Layer w0.305: U33.7 v1(29.05,33.87)
  Bottom Layer w0.254: v1(41.11,30.44) 40.79,30.12 R39.2
  Bottom Layer w0.305: 38.48,29.93 37.55,29.93 33.62,33.87 v1(29.05,33.87)
CANL: length 19.7
  Top Layer w0.254: v1(41.24,29.05) 40.06,29.05 CN4.2 40.1,28.33 40.1,27.78
  Top Layer w0.305: U33.6 v1(27.78,33.11)
  Bottom Layer w0.254: v1(41.24,29.05) 40.92,28.73 R39.1
  Bottom Layer w0.305: R39.1 38.92,28.41 37.81,28.41 33.11,33.11 v1(27.78,33.11)
CLK: length 4.2
  Top Layer w0.178: U20.41 22.2,19.13 22.31,19.01 22.31,18.3 v2(22.57,18.05)
  Bottom Layer w0.178: v2(22.57,18.05) 22.57,18.76 22.31,19.01 U28.7
CSN: length 3.5
  Top Layer w0.178: v2(20.83,18.33) 20.83,19.1 20.7,19.23 U20.38
  Bottom Layer w0.178: v2(20.83,18.33) 21.04,18.54 U28.8
M0_C: length 40.2
  Top Layer w0.305: v1(20.16,9.11) 19.39,9.87 ; v1(17.23,35.01) 17.17,35.01 C39.2 15.7,33.54 15.69,33.54 15.46,33.31 15.46,32.6 14.31,31.46 11.52,31.46 9.36,29.3 9.36,27.96 U19.12
  Inner1 w0.305: v1(20.16,9.11) 19.65,9.61 19.65,32.6 v1(17.23,35.01)
  vias: v1(14.42,4.14) v1(15.14,3.76) v1(15.75,3.07) v1(15.95,4.08) v1(16.48,4.66) v1(16.49,3.46) v1(16.98,5.21) v1(16.98,4) v1(17.53,4.53) v1(17.61,5.65) v1(18.09,5.07)
M0_HO1: length 3.8
  Top Layer w0.305: 15.71,24.91 13.92,26.69 U19.19
M0_HO2: length 4.3
  Top Layer w0.305: 14.31,24.91 13.09,26.12 12.66,26.12 11.97,26.82 U19.16
M0_HO3: length 4.7
  Top Layer w0.305: U19.13 10.02,26.98 10.5,26.51 11.01,26.51 12.61,24.91 12.92,24.91
M0_LO1: length 4.8
  Top Layer w0.305: U19.11 8.73,27.95 8.73,26.63 9.23,26.12 10.3,26.12 11.52,24.91
M0_LO2: length 10.4
  Top Layer w0.305: 8.78,25.05 8.71,24.98 7.84,24.98 7.46,25.36 7.46,30.19 8.72,31.45 U19.10
M0_LO3: length 10.6
  Top Layer w0.305: 10.12,25.04 9.54,25.62 8.6,25.62 8.09,26.12 8.09,29.93 9.37,31.22 U19.9
M0_PWM_A: length 23.3
  Top Layer w0.191: U20.32 18.11,22.58 17.11,23.58 17.11,27.14 17.74,27.78 18.5,27.78 18.76,28.03 18.76,36.41 15.33,39.84 14.31,39.84 13.93,39.46 R28.1
M0_PWM_B: length 25.3
  Top Layer w0.191: R29.1 12.41,39.84 12.92,40.35 15.71,40.35 19.27,36.79 19.27,28.03 18.55,27.31 18.04,27.31 17.49,26.76 17.49,23.84 18.25,23.08 U20.31
M0_PWM_C: length 27.4
  Top Layer w0.191: U20.30 18.38,23.58 17.87,24.09 17.87,26.51 18.25,26.89 18.76,26.89 19.77,27.9 19.77,37.3 16.22,40.86 11.9,40.86 10.88,39.84 R30.1
MISO: length 3.9
  Top Layer w0.178: v1(23.33,18.25) 22.86,18.72 22.86,18.73 22.7,18.89 U20.42
  Bottom Layer w0.178: v1(23.33,18.25) 23.58,18.5 U28.6
PB5: length 18.8
  Top Layer w0.178: U20.43 23.2,19.27 23.58,18.89 23.84,18.89 v2(24.09,18.63) ; v1(27.14,4.03) 27.39,3.77 NOREF#4.1
  Inner2 w0.178: v2(24.09,18.63) 26,16.73 26,6.31 27.14,5.17 v1(27.14,4.03)
SWCLK: length 31.8
  Top Layer w0.178: v2(20.24,18.74) 20.24,19.07 20.2,19.1 U20.37
  Top Layer w0.254: CN3.2 37.16,35.4 v1(37.16,35.52)
  Inner2 w0.178: v2(20.24,18.74) 20.24,19.85 20.93,20.54 26.63,20.54 27.65,21.55 27.65,28.92 32.22,33.49 35.4,33.49 37.16,35.26 v1(37.16,35.52)
SWDIO: length 32.2
  Top Layer w0.254: v2(18.12,21.03) 18.54,21.03 19,20.58 U20.36 ; CN3.3 36.28,35.93 v1(36.28,36.54)
  Inner2 w0.178: v1(36.28,36.54) 34.63,36.54 27.27,29.17 27.27,21.93 26.37,21.03 v2(18.12,21.03)
U3_R: length 18.3
  Top Layer w0.178: v3(21.81,18.76) 21.71,18.86 21.71,19.32 21.7,19.33 U20.40
  Top Layer w0.305: CN5.3 30.44,7.6 30.44,12.41 v1(30.57,12.54)
  Inner1 w0.178: v1(30.57,12.54) 29.81,13.3 28.92,13.3 25.87,16.35 23.46,16.35 21.93,17.87 21.93,18.63 v3(21.81,18.76)
U3_T: length 18.2
  Top Layer w0.178: U20.39 21.2,18.7 21.38,18.52 21.38,17.79 v2(21.43,17.74)
  Top Layer w0.305: v1(29.55,12.15) 29.55,7.14 CN5.2
  Inner1 w0.178: v1(29.55,12.15) 25.74,15.96 22.82,15.96 21.43,17.36 v2(21.43,17.74)
VM: length 48.9
  Top Layer w0.305: D19.2 21.93,28.92 v1(22.06,29.05) ; v1(9.87,36.03) 9.87,35.78 10.67,34.97 U19.7
  Top Layer w0.457: D19.2 D18.2 D17.2 21.04,33.7 v1(21.04,34.38)
  Inner1 w0.33: v1(14.82,21.17) 14.92,21.27 14.92,23.81 15.58,24.47 15.58,34.89 16.6,35.9 21.55,35.9 22.31,35.14 22.31,29.3 v1(22.06,29.05)
  Bottom Layer w0.305: v1(9.87,36.03) 19.39,36.03 v1(21.04,34.38)
  vias: v1(23.27,14.31) v1(23.27,13.55) v1(23.27,12.79) v1(23.27,12.03) v1(23.27,11.27) v1(23.27,10.5) v1(23.27,9.74) v1(23.31,15.02) v1(23.96,14.31) v1(23.96,13.55) v1(23.96,12.79) v1(23.96,12.03) v1(23.96,11.27) v1(23.96,10.5) v1(23.96,9.74) v1(24.01,15.02) v1(24.67,14.31) v1(24.67,13.55) v1(24.67,12.79) v1(24.67,12.03) v1(24.67,11.27) v1(24.67,10.5) v1(24.67,9.74) v1(24.71,15.02) v1(25.36,14.31) v1(25.36,13.55) v1(25.36,12.79) v1(25.36,12.03) v1(25.36,11.27) v1(25.36,10.5) v1(25.36,9.74) v1(25.41,15.02)
$1N3270: length 16.6
  Top Layer w0.28: 14.29,19.05 14.4,19.05 14.69,18.76 14.69,18 v1(13.42,16.73) ; R32.2 v1(15.71,23.2)
  Inner2 w0.28: v1(15.71,23.2) 14.82,24.09 12.15,24.09 11.14,23.08 11.14,19.01 v1(13.42,16.73)
$1N3271: length 12.3
  Top Layer w0.305: R33.2 11.01,23.53 11.01,22.83 9.75,21.57 7.52,21.57 5.51,19.57 5.51,17.8 6.61,16.7 7.37,16.7
$1N3277: length 19.3
  Top Layer w0.254: v1(16.6,12.66) 16.6,13.04 18.23,14.67 18.23,14.68 18.38,14.82 18.38,15.2 18.12,15.46 17.87,15.46
  Top Layer w0.305: v1(14.06,23.2) 14.31,23.46 R34.2
  Inner2 w0.305: v1(16.6,12.66) 16.6,14.82 12.03,19.39 12.03,23.03 12.31,23.3 13.17,23.3 13.27,23.2 v1(14.06,23.2)
$1N3278: length 14.2
  Top Layer w0.305: v1(10.63,11.9) 10.63,12.6 Q23.4 ; R35.2 v1(8.78,22.82)
  Inner2 w0.305: v1(8.78,22.82) 8.78,13.76 v1(10.63,11.9)
$1N3284: length 20.3
  Top Layer w0.305: R36.2 v1(12.92,22.7) ; 21.4,11.94 21.81,11.54 21.81,9.87 v1(21.68,9.74)
  Inner2 w0.305: v1(12.92,22.7) 12.92,19.65 21.68,10.88 v1(21.68,9.74)
$1N3285: length 19.7
  Top Layer w0.305: R37.2 10.12,24.04 v1(10.12,23.2) ; 14.57,9.48 14.05,8.96 v2(14.05,8.03)
  Inner2 w0.305: v2(14.05,8.03) 14.05,10.01 9.61,14.44 9.61,22.7 v1(10.12,23.2)
$1N3290: length 14.2
  Top Layer w0.203: 12.41,36.23 12.86,36.23 13.17,36.54 13.17,37.63 R29.2
  Top Layer w0.254: U19.5 11.97,35.09 12.41,35.52 12.41,36.23
  Top Layer w0.305: v1(14.69,35.4) 14.69,35.19 13.92,34.42 U19.2 ; U19.5 v1(11.97,32.35)
  Bottom Layer w0.305: v1(14.69,35.4) 14.69,33.62 13.42,32.35 v1(11.97,32.35)
$1N3300: length 3.4
  Top Layer w0.33: 17.57,28.79 16.63,27.86 C37.1 14.67,27.86 U19.20
$1N3301: length 7.1
  Top Layer w0.305: 17.57,31.2 16.7,30.33 C38.1 15.66,29.93 13.17,29.93 12.62,29.39 U19.17
$1N3302: length 10.3
  Top Layer w0.305: 17.57,33.62 16.79,32.84 C39.1 16.09,32.6 14.44,30.95 12.15,30.95 10.67,29.47 U19.14
$1N3388: length 11.6
  Top Layer w0.203: R28.2 14.62,38.39 15.08,37.94 15.08,36.92 14.39,36.23 13.93,36.23
  Top Layer w0.254: 13.93,36.23 12.62,34.92 U19.4 12.62,32.39 12.92,32.09 14.19,32.09 14.57,32.48 U19.1
$1N3389: length 14.2
  Top Layer w0.203: U19.6 11.32,34.96 10.88,35.4 10.88,36.23 11.09,36.23 11.52,36.67 11.52,37.76 R30.2
  Top Layer w0.305: U19.3 13.27,34.73 v1(13.81,35.27) ; v1(10.88,32.09) 11.32,32.53 U19.6
  Bottom Layer w0.305: v1(13.81,35.27) 13.81,34.25 12.79,33.24 11.65,33.24 10.88,32.47 v1(10.88,32.09)
$1N3414: length 10.8
  Top Layer w0.381: v2(30.7,24.09) 30.7,24.87 U34.2 ; C45.1 31.09,26.9 32.09,27.9 33.36,27.9 33.91,27.35 U27.2 v1(33.91,25.87)
  Bottom Layer w0.381: v1(33.91,25.87) 33.91,24.39 33.62,24.09 v2(30.7,24.09)
$1N3417: length 2.3
  Top Layer w0.381: U27.6 32.48,28.9 C45.2
$1N3418: length 4
  Top Layer w0.305: U27.5 33.91,28.5 34.12,28.28 36.24,28.28 36.7,28.74
$1N3419: length 3.4
  Top Layer w0.457: R43.1 34.8,32.78 R42.1 34.86,30.99 U27.4
$1N10197: length 2.4
  Top Layer w0.28: U20.46 24.7,17.4 R50.1

## Copper pours and planes (outline as drawn; the poured copper is in the pictures)
GND on Top Layer: -10.96,54.32 54.19,54.32 54.19,-9.31 -10.96,-9.31
GND on Top Layer: 14.08,11.98 16.38,11.98 16.38,9.55 14.08,9.55
GND on Top Layer: 6.89,20.62 9.81,20.62 9.81,16.78 6.89,16.78
GND on Top Layer: 10.58,15.99 12.8,15.99 12.8,13.09 10.58,13.09
GND on Top Layer: 26.89,17.74 31.46,17.74 31.46,13.82 26.89,13.82
GND on Bottom Layer: 35.02,18.91 38.32,18.91 38.32,8.91 35.02,8.91
GND on Bottom Layer: 27.01,17.68 31.08,17.68 31.08,13.69 27.01,13.69
GND on Bottom Layer: -6.9,51.65 50.25,51.65 50.25,-5.12 -6.9,-5.12
GND on Inner1: 27.39,17.87 31.33,17.87 31.33,14.19 27.39,14.19
GND on Inner1: -7.78,50.89 54.83,50.89 54.83,-8.42 -7.78,-8.42
GND on Inner2: -6.9,48.48 50.89,48.48 50.89,-2.45 -6.9,-2.45
GND on Inner2: 27.27,17.74 31.08,17.74 31.08,13.93 27.27,13.93
VCC_3.3V on Top Layer: 27.7,24.72 31.81,24.72 31.81,21.84 27.7,21.84
VCC_3.3V on Top Layer: 27.71,26.39 29.3,26.39 29.3,24.45 27.71,24.45
A0+ on Top Layer: 5.97,18.97 14.21,18.97 14.21,11.7 5.97,11.7
A0- on Top Layer: 5.1,11.84 10.32,11.84 10.32,7.78 5.1,7.78
A0- on Top Layer: 3.99,12.52 6.5,12.52 6.5,10.05 3.99,10.05
A0- on Bottom Layer: 3.22,18.03 8.21,18.03 8.21,8.8 3.22,8.8
B0+ on Top Layer: 9.67,15.37 17.72,15.37 17.72,7.85 9.67,7.85
B0- on Top Layer: 8.53,7.96 13.99,7.96 13.99,4.35 8.53,4.35
B0- on Bottom Layer: 6.89,11.55 12.67,11.55 12.67,4.34 6.89,4.34
M0_C on Top Layer: 13.28,8.76 18.62,8.76 18.62,2.65 13.28,2.65
M0_C on Top Layer: 15.16,11.83 21.33,11.83 21.33,6.89 15.16,6.89
M0_C on Bottom Layer: 13.26,8.5 18.7,8.5 18.7,2.66 13.26,2.66
VM on Top Layer: 10.25,21.93 26,21.93 26,9.11 10.25,9.11
VM on Top Layer: 30.44,27.68 37.29,27.68 37.29,17.89 30.44,17.89
VM on Bottom Layer: 22.57,21.44 34.38,21.44 34.38,8.6 22.57,8.6

Small or netless copper shapes (teardrops, artwork), in the pictures only: 171 on Top Layer, 51 on Bottom Layer, 12 on Inner1, 19 on Inner2

## Text on the board
Top Silkscreen Layer: V_3.3 | TX | RX | GND | VM | CAN_H | CAN_L | G
